# EAGLE design GlowDriver (EAGLE 6.3)
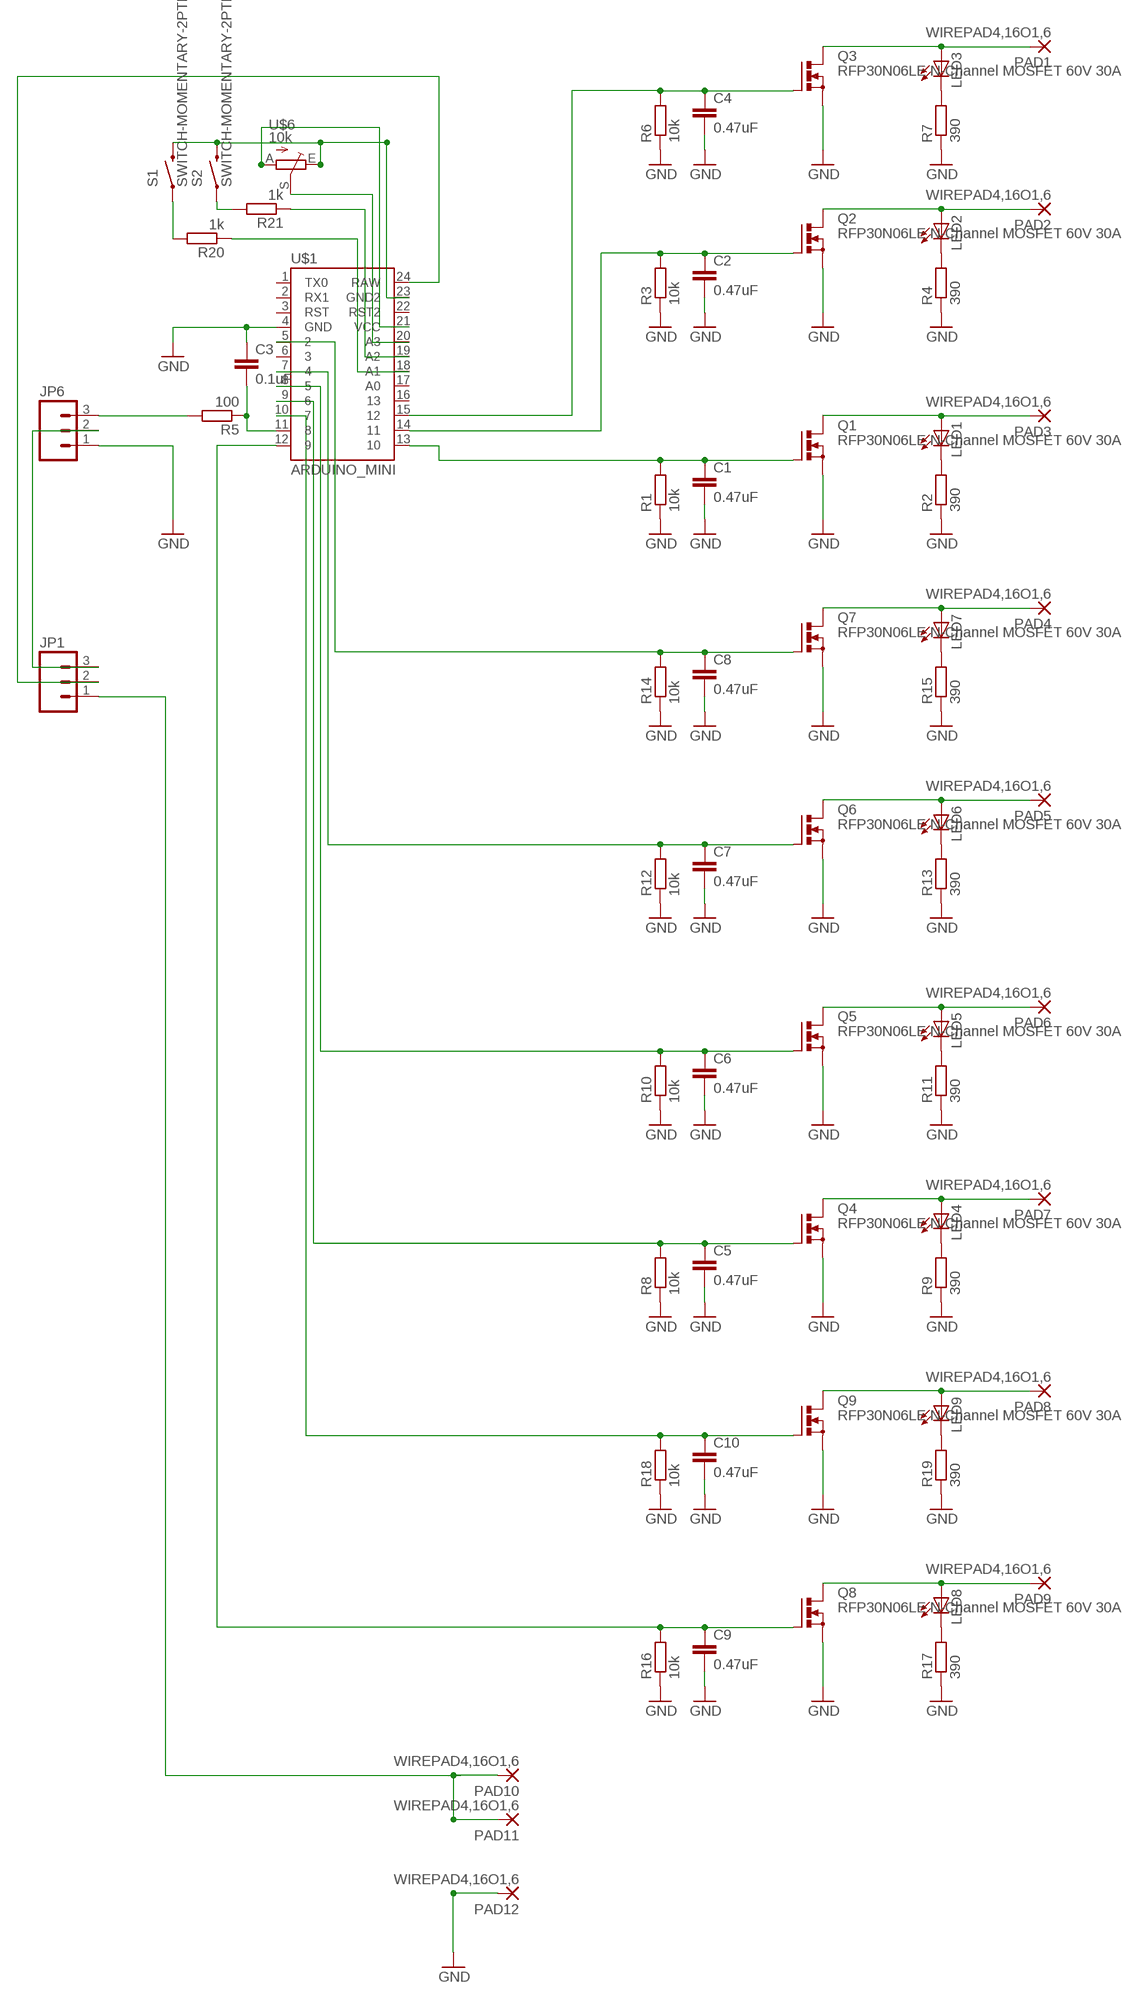
[diagram p0: schematic, sheet 1]

## Parts
C1  0.47uF  CAPEZ  [CAP-PTH-SMALLEZ]
C2  0.47uF  CAPEZ  [CAP-PTH-SMALLEZ]
C3  0.1uF  C-EU050-035X075  [C050-035X075]
C4  0.47uF  CAPEZ  [CAP-PTH-SMALLEZ]
C5  0.47uF  CAPEZ  [CAP-PTH-SMALLEZ]
C6  0.47uF  CAPEZ  [CAP-PTH-SMALLEZ]
C7  0.47uF  CAPEZ  [CAP-PTH-SMALLEZ]
C8  0.47uF  CAPEZ  [CAP-PTH-SMALLEZ]
C9  0.47uF  CAPEZ  [CAP-PTH-SMALLEZ]
C10  0.47uF  CAPEZ  [CAP-PTH-SMALLEZ]
JP1  M03PTH  [1X03]
JP6  M03PTH  [1X03]
LED1  LED5MM  [LED5MM]
LED2  LED5MM  [LED5MM]
LED3  LED5MM  [LED5MM]
LED4  LED5MM  [LED5MM]
LED5  LED5MM  [LED5MM]
LED6  LED5MM  [LED5MM]
LED7  LED5MM  [LED5MM]
LED8  LED5MM  [LED5MM]
LED9  LED5MM  [LED5MM]
PAD1  WIREPAD4,16O1,6  [4,16O1,6]
PAD2  WIREPAD4,16O1,6  [4,16O1,6]
PAD3  WIREPAD4,16O1,6  [4,16O1,6]
PAD4  WIREPAD4,16O1,6  [4,16O1,6]
PAD5  WIREPAD4,16O1,6  [4,16O1,6]
PAD6  WIREPAD4,16O1,6  [4,16O1,6]
PAD7  WIREPAD4,16O1,6  [4,16O1,6]
PAD8  WIREPAD4,16O1,6  [4,16O1,6]
PAD9  WIREPAD4,16O1,6  [4,16O1,6]
PAD10  WIREPAD4,16O1,6  [4,16O1,6]
PAD11  WIREPAD4,16O1,6  [4,16O1,6]
PAD12  WIREPAD4,16O1,6  [4,16O1,6]
Q1  RFP30N06LE N-Channel MOSFET 60V 30A  PMOSFET_NTO220BV  [TO220BV]
Q2  RFP30N06LE N-Channel MOSFET 60V 30A  PMOSFET_NTO220BV  [TO220BV]
Q3  RFP30N06LE N-Channel MOSFET 60V 30A  PMOSFET_NTO220BV  [TO220BV]
Q4  RFP30N06LE N-Channel MOSFET 60V 30A  PMOSFET_NTO220BV  [TO220BV]
Q5  RFP30N06LE N-Channel MOSFET 60V 30A  PMOSFET_NTO220BV  [TO220BV]
Q6  RFP30N06LE N-Channel MOSFET 60V 30A  PMOSFET_NTO220BV  [TO220BV]
Q7  RFP30N06LE N-Channel MOSFET 60V 30A  PMOSFET_NTO220BV  [TO220BV]
Q8  RFP30N06LE N-Channel MOSFET 60V 30A  PMOSFET_NTO220BV  [TO220BV]
Q9  RFP30N06LE N-Channel MOSFET 60V 30A  PMOSFET_NTO220BV  [TO220BV]
R1  10k  R-EU_0207/2V  [0207/2V]
R2  390  R-EU_0207/2V  [0207/2V]
R3  10k  R-EU_0207/2V  [0207/2V]
R4  390  R-EU_0207/2V  [0207/2V]
R5  100  R-EU_0207/10  [0207/10]
R6  10k  R-EU_0207/2V  [0207/2V]
R7  390  R-EU_0207/2V  [0207/2V]
R8  10k  R-EU_0207/2V  [0207/2V]
R9  390  R-EU_0207/2V  [0207/2V]
R10  10k  R-EU_0207/2V  [0207/2V]
R11  390  R-EU_0207/2V  [0207/2V]
R12  10k  R-EU_0207/2V  [0207/2V]
R13  390  R-EU_0207/2V  [0207/2V]
R14  10k  R-EU_0207/2V  [0207/2V]
R15  390  R-EU_0207/2V  [0207/2V]
R16  10k  R-EU_0207/2V  [0207/2V]
R17  390  R-EU_0207/2V  [0207/2V]
R18  10k  R-EU_0207/2V  [0207/2V]
R19  390  R-EU_0207/2V  [0207/2V]
R20  1k  R-EU_0207/2V  [0207/2V]
R21  1k  R-EU_0207/2V  [0207/2V]
S1  SWITCH-MOMENTARY-2PTH  [TACTILE-PTH]
S2  SWITCH-MOMENTARY-2PTH  [TACTILE-PTH]
U$1  ARDUINO_MINI  [ARDUINO_MINI]
U$6  10k  TRIM_EU-PT10  [PT-10]

## Nets
GND: C1.2 C2.2 C3.1 C4.2 C5.2 C6.2 C7.2 C8.2 C9.2 C10.2 JP6.1 PAD12.1(P) Q1.S Q2.S Q3.S Q4.S Q5.S Q6.S Q7.S Q8.S Q9.S R1.1 R2.1 R3.1 R4.1 R6.1 R7.1 R8.1 R9.1 R10.1 R11.1 R12.1 R13.1 R14.1 R15.1 R16.1 R17.1 R18.1 R19.1 U$1.4(GND)
N$1: LED1.K(C) R2.2
N$2: C1.1 Q1.G R1.2 U$1.13
N$3: LED1.A PAD3.1(P) Q1.D
N$4: LED2.K(C) R4.2
N$5: C2.1 Q2.G R3.2 U$1.14
N$6: LED2.A PAD2.1(P) Q2.D
N$7: LED4.K(C) R9.2
N$8: JP1.2 U$1.24(RAW)
N$9: LED5.K(C) R11.2
N$10: C6.1 Q5.G R10.2 U$1.8
N$11: C3.2 R5.1 U$1.11
N$12: LED5.A PAD6.1(P) Q5.D
N$13: JP6.3 R5.2
N$14: JP1.1 PAD10.1(P) PAD11.1(P)
N$15: U$1.20(A3) U$6.S
N$16: U$1.21(VCC) U$6.A
N$18: C10.1 Q9.G R18.2 U$1.10
N$19: C5.1 Q4.G R8.2 U$1.9
N$20: LED3.K(C) R7.2
N$21: C4.1 Q3.G R6.2 U$1.15
N$22: LED3.A PAD1.1(P) Q3.D
N$23: LED4.A PAD7.1(P) Q4.D
N$24: JP1.3 JP6.2
N$25: LED6.K(C) R13.2
N$26: C7.1 Q6.G R12.2 U$1.7
N$27: LED6.A PAD5.1(P) Q6.D
N$28: LED7.K(C) R15.2
N$29: C8.1 Q7.G R14.2 U$1.5
N$30: LED7.A PAD4.1(P) Q7.D
N$31: C9.1 Q8.G R16.2 U$1.12
N$32: LED8.K(C) R17.2
N$33: LED8.A PAD9.1(P) Q8.D
N$34: LED9.K(C) R19.2
N$35: R21.1 U$1.19(A2)
N$36: LED9.A PAD8.1(P) Q9.D
N$37: R20.1 U$1.18(A1)
N$38: R20.2 S1.1
N$39: R21.2 S2.1
N$40: S1.3 S2.3 U$1.23(GND2) U$6.E
Unconnected: U$1.1(TX0) U$1.2(RX1) U$1.3(RST) U$1.6 U$1.16 U$1.17(A0) U$1.22(RST2)

## Library data of the parts
C1 C2 C4-C10 = SparkFun-Passives:CAP: Capacitor Standard 0603 ceramic capacitor, and 0.1" leaded capacitor.
C3 = rcl:C-EU: CAPACITOR, European symbol
JP1 JP6 = SparkFun-Connectors:M03: Header 3 Standard 3-pin 0.1" header. Use with straight break away headers (SKU : PRT-00116), right angle break away headers (PRT-00553), swiss pins (PRT-00743), machine pins (PRT-00117), and female headers (PRT-00115). Molex polarized connector foot print use with SKU : PRT-08232 with associated crimp pins and housings.
LED1-LED9 = led:LED: LED OSRAM: - CHIPLED LG R971, LG N971, LY N971, LG Q971, LY Q971, LO R971, LY R971 LH N974, LH R974 LS Q976, LO Q976, LY Q976 LO Q996 - Hyper CHIPLED LW Q18S LB Q993, LB Q99A, LB R99A - SideLED LS A670, LO A670, LY A670, LG A670, LP A670 LB A673, LV A673, LT A673, LW A673 LH A674 LY A675 LS A676, LA A676, LO A676, LY A676, LW A676 LS A679, LY A679, LG A679 - Hyper Micro SIDELED® LS Y876, LA Y876, LO Y876, LY Y876 LT Y87S - SmartLED LW L88C, LW L88S LB L89C, LB L89S, LG L890 LS L89K, LO L89K, LY L89K LS L896, LA L896, LO L896, LY L896 - TOPLED LS T670, LO T670, LY T670, LG T670, LP T670 LSG T670, LSP T670, LSY T670, LOP T670, LYG T670 LG T671, LOG T671, LSG T671 LB T673, LV T673, LT T673, LW T673 LH T674 LS T676, LA T676, LO T676, LY T676, LB T676, LH T676, LSB T676, LW T676 LB T67C, LV T67C, LT T67C, LS T67K, LO T67K, LY T67K, LW E67C LS E67B, LA E67B, LO E67B, LY E67B, LB E67C, LV E67C, LT E67C LW T67C LS T679, LY T679, LG T679 LS T770, LO T770, LY T770, LG T770, LP T770 LB T773, LV T773, LT T773, LW T773 LH T774 LS E675, LA E675, LY E675, LS T675 LS T776, LA T776, LO T776, LY T776, LB T776 LHGB T686 LT T68C, LB T68C - Hyper Mini TOPLED® LB M676 - Mini TOPLED Santana® LG M470 LS M47K, LO M47K, LY M47K Source: http://www.osram.convergy.de LUXEON: - LUMILED® LXK2-PW12-R00, LXK2-PW12-S00, LXK2-PW14-U00, LXK2-PW14-V00 LXK2-PM12-R00, LXK2-PM12-S00, LXK2-PM14-U00 LXK2-PE12-Q00, LXK2-PE12-R00, LXK2-PE12-S00, LXK2-PE14-T00, LXK2-PE14-U00 LXK2-PB12-K00, LXK2-PB12-L00, LXK2-PB12-M00, LXK2-PB14-N00, LXK2-PB14-P00, LXK2-PB14-Q00 LXK2-PR12-L00, LXK2-PR12-M00, LXK2-PR14-Q00, LXK2-PR14-R00 LXK2-PD12-Q00, LXK2-PD12-R00, LXK2-PD12-S00 LXK2-PH12-R00, LXK2-PH12-S00 LXK2-PL12-P00, LXK2-PL12-Q00, LXK2-PL12-R00 Source: www.luxeon.com KINGBRIGHT: KA-3528ASYC Source: www.kingbright.com
PAD1-PAD12 = wirepad:WIREPAD: Wire PAD connect wire on PCB
Q1-Q9 = transistor-power:PMOSFET_N: Power MOSFET N-Channel
R1-R21 = rcl:R-EU_: RESISTOR, European symbol
S1 S2 = SparkFun-Electromechanical:SWITCH-MOMENTARY-2: Various NO switches- pushbuttons, reed, etc
U$1 = SparkFun-Boards:ARDUINO_MINI: Arduino Pro Mini footprint
U$6 = pot:TRIM_EU-: POTENTIOMETER

## Board
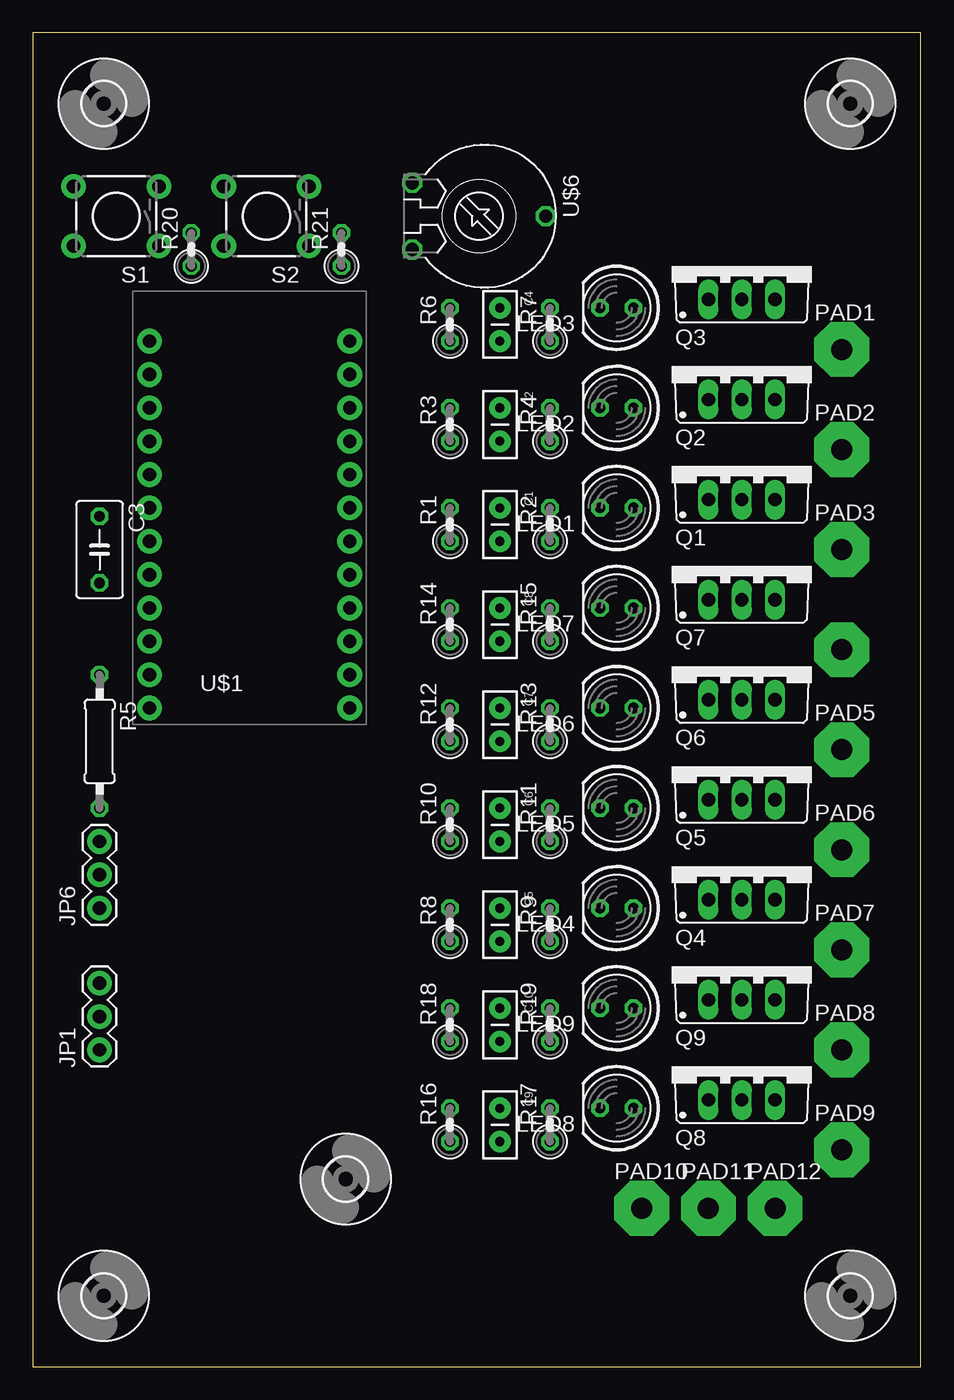
[diagram p1: board, top side]
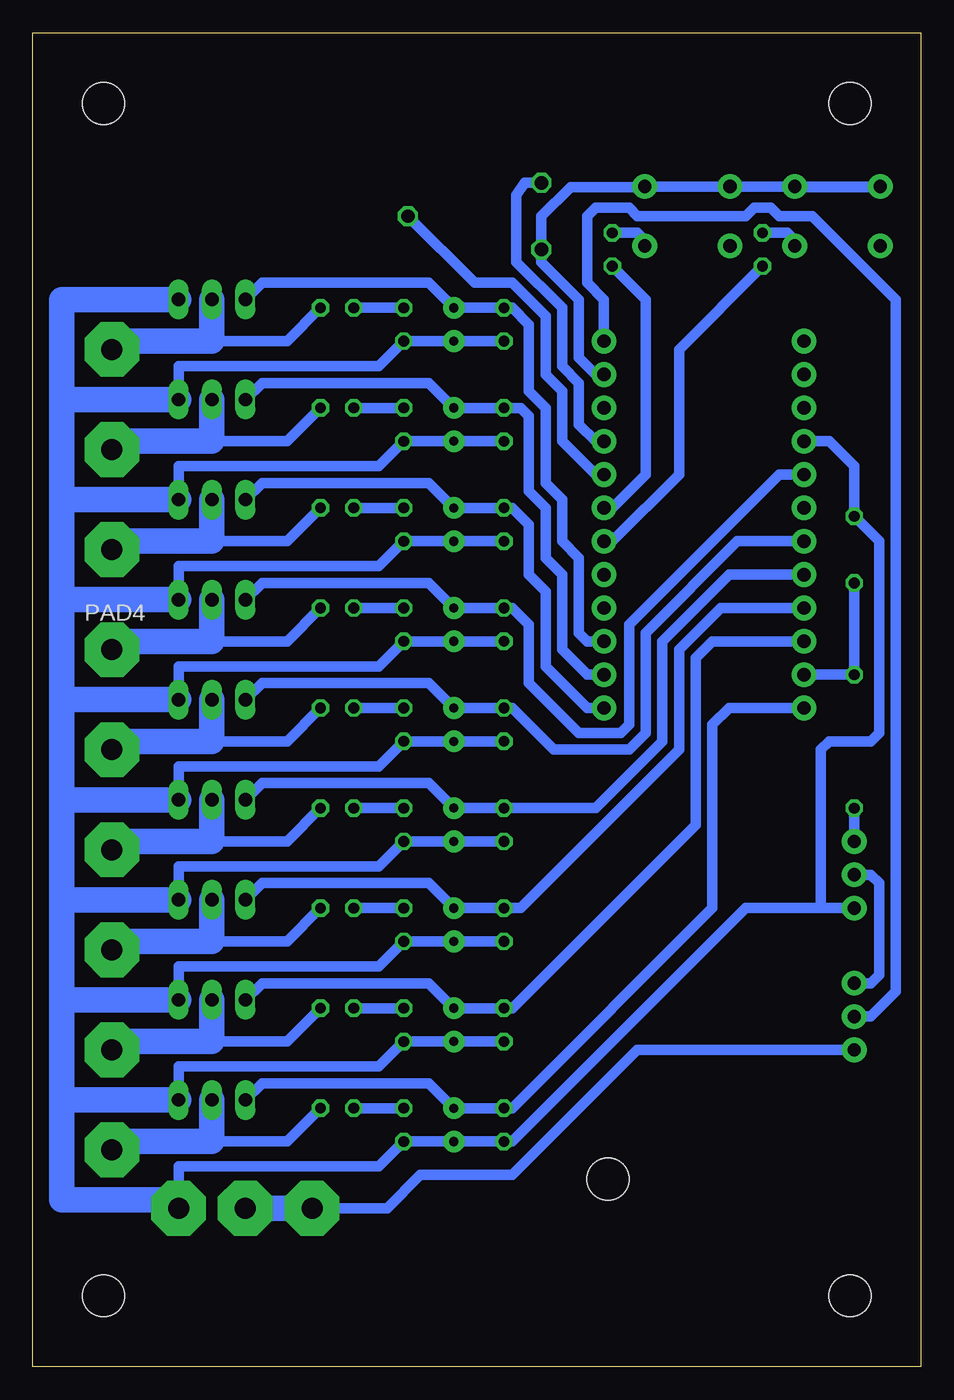
[diagram p2: board, bottom side, seen from below]

Size 67.62 x 101.59 mm. Coordinates in mm from the lower left corner, seen from the top.
Outline: 0,0 67.62,0 67.62,101.59 0,101.59 0,0
Copper layers (1*16): Top 0.035mm / dielectric 1.5mm / Bottom 0.035mm
Design rules "pawDesignRules": minimum track width 10mil, minimum drill 24mil, track to track 18mil, track to pad 18mil, pad to pad 18mil, via to via 18mil, smd to smd 8mil, copper to edge 40mil, drill to drill 8mil, minimum pad ring 10mil, minimum via ring 8mil, stop-mask expansion 4mil, vias tented up to drill 0mil, thermal gap 10mil

### Footprints (pad centres in the part's own frame; a part is rotated, then mirrored left to right if it is on the bottom)
CAP-PTH-SMALLEZ = drill 0.7 pad 1.651: 1 0,0; 2 2.54,0
C050-035X075 = drill 0.813 octagon: 1 -2.54,0; 2 2.54,0
1X03 = drill 1.016 pad 1.88: 1 0,0; 2 2.54,0; 3 5.08,0
LED5MM = drill 0.813 octagon: A -1.27,0; K 1.27,0
4,16O1,6 = drill 1.6 pad 4.166 octagon: 1 0,0
TO220BV = drill 1.016 long: D 0,-2.54; G -2.54,-2.54; S 2.54,-2.54
0207/2V = drill 0.813 octagon: 1 -1.27,0; 2 1.27,0
0207/10 = drill 0.813 octagon: 1 -5.08,0; 2 5.08,0
TACTILE-PTH = drill 1.016 pad 1.88: 1 -3.251,2.261; 2 3.251,2.261; 3 -3.251,-2.261; 4 3.251,-2.261
ARDUINO_MINI = drill 1.016 pad 1.88: 1 -7.62,12.7; 2 -7.62,10.16; 3 -7.62,7.62; 4 -7.62,5.08; 5 -7.62,2.54; 6 -7.62,0; 7 -7.62,-2.54; 8 -7.62,-5.08; 9 -7.62,-7.62; 10 -7.62,-10.16; 11 -7.62,-12.7; 12 -7.62,-15.24; 13 7.62,-15.24; 14 7.62,-12.7; 15 7.62,-10.16; 16 7.62,-7.62; 17 7.62,-5.08; 18 7.62,-2.54; 19 7.62,0; 20 7.62,2.54; 21 7.62,5.08; 22 7.62,7.62; 23 7.62,10.16; 24 7.62,12.7
3,2 = hole 3.2: 0,0
PT-10 = drill 1.016 octagon: A -2.54,-5.08; E 2.54,-5.08; S 0,5.08

### Placement (x,y rotation side)
C1  35.56,65.41 270 top
C2  35.56,73.03 270 top
C3  5.08,62.23 270 top
C4  35.56,80.64 270 top
C5  35.56,34.92 270 top
C6  35.56,42.55 270 top
C7  35.56,50.16 270 top
C8  35.56,57.79 270 top
C9  35.56,19.69 270 top
C10  35.56,27.3 270 top
JP1  5.08,24.13 90 top
JP6  5.08,34.92 90 top
LED1  44.45,65.41 180 top
LED2  44.45,73.03 180 top
LED3  44.45,80.64 180 top
LED4  44.45,34.92 180 top
LED5  44.45,42.55 180 top
LED6  44.45,50.16 180 top
LED7  44.45,57.79 180 top
LED8  44.45,19.69 180 top
LED9  44.45,27.3 180 top
PAD1  61.59,77.47 0 top
PAD2  61.59,69.85 0 top
PAD3  61.59,62.23 0 top
PAD4  61.59,54.61 0 bottom
PAD5  61.59,46.99 0 top
PAD6  61.59,39.37 0 top
PAD7  61.59,31.75 0 top
PAD8  61.59,24.13 0 top
PAD9  61.59,16.51 0 top
PAD10  46.36,12.07 0 top
PAD11  51.44,12.07 0 top
PAD12  56.52,12.07 0 top
Q1  53.98,68.58 0 top
Q2  53.98,76.2 0 top
Q3  53.98,83.82 0 top
Q4  53.98,38.1 0 top
Q5  53.98,45.72 0 top
Q6  53.98,53.34 0 top
Q7  53.98,60.96 0 top
Q8  53.98,22.86 0 top
Q9  53.98,30.48 0 top
R1  31.75,64.13 90 top
R2  39.37,64.13 90 top
R3  31.75,71.75 90 top
R4  39.37,71.75 90 top
R5  5.08,47.62 270 top
R6  31.75,79.38 90 top
R7  39.37,79.38 90 top
R8  31.75,33.66 90 top
R9  39.37,33.66 90 top
R10  31.75,41.27 90 top
R11  39.37,41.27 90 top
R12  31.75,48.9 90 top
R13  39.37,48.9 90 top
R14  31.75,56.52 90 top
R15  39.37,56.52 90 top
R16  31.75,18.41 90 top
R17  39.37,18.41 90 top
R18  31.75,26.04 90 top
R19  39.37,26.04 90 top
R20  12.06,85.09 90 top
R21  23.5,85.09 90 top
S1  6.35,87.63 180 top
S2  17.78,87.63 180 top
U$1  16.51,65.41 0 top
U$2  [3,2]  5.4,5.4 0 top
U$3  [3,2]  5.4,96.2 0 top
U$4  [3,2]  62.23,96.2 0 top
U$5  [3,2]  23.81,14.29 0 top
U$6  33.97,87.63 270 top
U$8  [3,2]  62.23,5.4 0 top

### Tracks (layer width: path | path; a pad name or v marks a point on that pad's centre or on a via)
GND
  Bottom 0.813: R3.1 C2.2 R4.1 41.28,68.58 56.52,68.58 Q1.S | R1.1 C1.2 R2.1 41.28,60.96 56.52,60.96 Q7.S | R6.1 C4.2 R7.1 41.28,76.2 56.52,76.2 Q2.S | R14.1 C8.2 R15.1 41.28,53.34 56.52,53.34 Q6.S | R12.1 C7.2 R13.1 41.28,45.72 56.52,45.72 Q5.S | R10.1 C6.2 R11.1 41.28,38.1 56.52,38.1 Q4.S | R8.1 C5.2 R9.1 41.28,30.48 56.52,30.48 Q9.S | R18.1 C10.2 R19.1 41.28,22.86 56.52,22.86 56.52,20.95 57.15,20.32 | 56.52,12.7 56.52,15.24 41.28,15.24 R17.1 C9.2 R16.1 31.11,17.15 13.33,34.92 7.62,34.92 | U$1.4 6.98,70.48 5.08,68.58 C3.1 3.18,62.87 3.18,48.26 3.81,47.62 6.98,47.62 7.62,46.99 7.62,34.92 | 7.62,34.92 JP6.1
  Bottom 1.93: Q2.S 65.41,73.66 | 65.41,73.66 65.41,66.04 | 65.41,66.04 Q1.S | Q3.S 65.41,81.28 65.41,73.66 | 65.41,66.04 65.41,58.42 | 65.41,58.42 65.41,50.8 | 65.41,50.8 65.41,43.18 | 65.41,43.18 65.41,35.56 | 65.41,35.56 65.41,27.94 | 65.41,27.94 65.41,20.32 | 65.41,20.32 65.41,12.7 56.52,12.7 PAD12.1 | Q7.S 65.41,58.42 | Q6.S 65.41,50.8 | Q5.S 65.41,43.18 | Q4.S 65.41,35.56 | Q9.S 65.41,27.94 | Q8.S 57.15,20.32 65.41,20.32
N$1
  Bottom 0.813: LED1.K R2.2
N$2
  Bottom 0.813: Q1.G 50.17,67.31 37.47,67.31 C1.1 R1.2 31.11,65.41 29.85,64.13 29.85,60.33 28.57,59.05 28.57,53.34 25.4,50.16 U$1.13
N$3
  Bottom 0.813: 53.98,62.87 48.26,62.87 LED1.A
  Bottom 1.93: Q1.D 53.98,62.87 60.96,62.87 PAD3.1
N$4
  Bottom 0.813: R4.2 LED2.K
N$5
  Bottom 0.813: Q2.G 50.17,74.93 37.47,74.93 C2.1 R3.2 30.48,73.03 29.85,72.39 29.85,66.67 28.57,65.41 28.57,61.59 27.3,60.33 27.3,54.61 25.4,52.7 U$1.14
N$6
  Bottom 0.813: LED2.A 48.26,70.48 53.98,70.48
  Bottom 1.93: Q2.D 53.98,70.48 60.96,70.48 PAD2.1
N$7
  Bottom 0.813: R9.2 LED4.K
N$8
  Bottom 0.813: U$1.24 24.13,81.28 25.4,82.55 25.4,87.63 24.76,88.27 22.22,88.27 21.59,87.63 13.33,87.63 12.7,88.27 11.43,88.27 10.79,87.63 8.25,87.63 1.9,81.28 1.9,28.57 3.81,26.67 JP1.2
N$9
  Bottom 0.813: LED5.K R11.2
N$10
  Bottom 0.813: Q5.G 50.17,44.45 37.47,44.45 C6.1 R10.2 24.76,42.55 19.68,47.62 19.68,55.24 14.61,60.33 U$1.8
N$11
  Bottom 0.813: C3.2 R5.1 U$1.11
N$12
  Bottom 0.813: LED5.A 48.26,40 53.98,40
  Bottom 1.93: Q5.D 53.98,40 60.96,40 PAD6.1
N$13
  Bottom 0.813: R5.2 JP6.3
N$14
  Bottom 0.813: JP1.1 21.59,24.13 31.11,14.61 38.1,14.61 40.64,12.07 PAD10.1
  Bottom 1.93: PAD10.1 PAD11.1
N$15
  Bottom 0.813: U$1.20 24.76,67.94 27.3,70.48 27.3,74.3 28.57,75.56 28.57,80.01 31.11,82.55 33.97,82.55 U$6.S
N$16
  Bottom 0.813: U$6.A 30.16,90.17 30.8,89.22 30.8,84.14 27.3,80.64 27.3,76.2 26.04,74.93 26.04,71.75 24.76,70.48 U$1.21
N$18
  Bottom 0.813: Q9.G 50.17,29.21 37.47,29.21 C10.1 R18.2 31.11,27.3 17.14,41.27 17.14,53.98 15.87,55.24 U$1.10
N$19
  Bottom 0.813: Q4.G 50.17,36.83 37.47,36.83 C5.1 R8.2 30.48,34.92 18.42,46.99 18.42,54.61 15.24,57.79 U$1.9
N$20
  Bottom 0.813: R7.2 LED3.K
N$21
  Bottom 0.813: Q3.G 50.17,82.55 37.47,82.55 C4.1 R6.2 31.11,80.64 29.85,79.38 29.85,74.3 28.57,73.03 28.57,67.31 27.3,66.04 27.3,62.87 26.04,61.59 26.04,55.88 25.4,55.24 U$1.15
N$22
  Bottom 0.813: LED3.A 48.26,78.11 53.98,78.11
  Bottom 1.93: Q3.D 53.98,78.11 60.96,78.11 PAD1.1
N$23
  Bottom 0.813: LED4.A 48.26,32.39 54.61,32.39
  Bottom 1.93: Q4.D 53.98,32.39 54.61,32.39 60.96,32.39 PAD7.1
N$24
  Bottom 0.813: JP6.2 3.81,37.47 3.18,36.83 3.18,29.84 3.81,29.21 JP1.3
N$25
  Bottom 0.813: R13.2 LED6.K
N$26
  Bottom 0.813: Q6.G 50.17,52.07 37.47,52.07 C7.1 R12.2 31.11,50.16 27.94,46.99 22.22,46.99 20.96,48.26 20.96,55.88 13.97,62.87 U$1.7
N$27
  Bottom 0.813: LED6.A 48.26,47.62 53.98,47.62
  Bottom 1.93: Q6.D 53.98,47.62 60.96,47.62 PAD5.1
N$28
  Bottom 0.813: R15.2 LED7.K
N$29
  Bottom 0.813: Q7.G 50.17,59.69 37.47,59.69 C8.1 R14.2 31.11,57.79 29.85,56.52 29.85,52.07 26.04,48.26 22.86,48.26 22.22,48.9 22.22,56.52 10.79,67.94 U$1.5
N$30
  Bottom 0.813: LED7.A 48.26,55.24 53.98,55.24
  Bottom 1.93: Q7.D 53.98,55.24 60.96,55.24 PAD4.1
N$31
  Bottom 0.813: Q8.G 50.17,21.59 37.47,21.59 C9.1 R16.2 31.11,19.69 15.87,34.92 15.87,48.9 14.61,50.16 U$1.12
N$32
  Bottom 0.813: R17.2 LED8.K
N$33
  Bottom 0.813: LED8.A 48.26,17.15 53.98,17.15
  Bottom 1.93: Q8.D 53.98,17.15 60.96,17.15 PAD9.1
N$34
  Bottom 0.813: R19.2 LED9.K
N$35
  Bottom 0.813: U$1.19 23.5,65.41 20.96,67.94 20.96,81.28 R21.1
N$36
  Bottom 0.813: LED9.A 48.26,24.77 53.98,24.77
  Bottom 1.93: Q9.D 53.98,24.77 60.96,24.77 PAD8.1
N$37
  Bottom 0.813: R20.1 18.42,77.47 18.42,67.94 23.5,62.87 U$1.18
N$38
  Bottom 0.813: S1.1 9.6,85.8 10.16,86.36 R20.2
N$39
  Bottom 0.813: S2.1 21.03,85.8 21.59,86.36 R21.2
N$40
  Bottom 0.813: U$1.23 24.76,75.56 26.04,76.83 26.04,81.28 28.89,84.14 U$6.E 28.89,87.63 26.67,89.85 21.07,89.85 S2.3 S1.3 | S1.3 3.21,89.89 3.18,89.85 9.56,89.85 S1.3